# Altium schematic sheet Power Supply Unit.SchDoc: Power Supply Unit
size A4; DrawnBy: Maxime Tousignant-Tremblay; DocumentNumber: GPH-3110-1; Revision: 1; SheetNumber: 3; SheetTotal: 4; SPICEModelCacheSEIOAEZJ: <root> / <DocumentId>SEIOAEZJ</DocumentId> / </root>
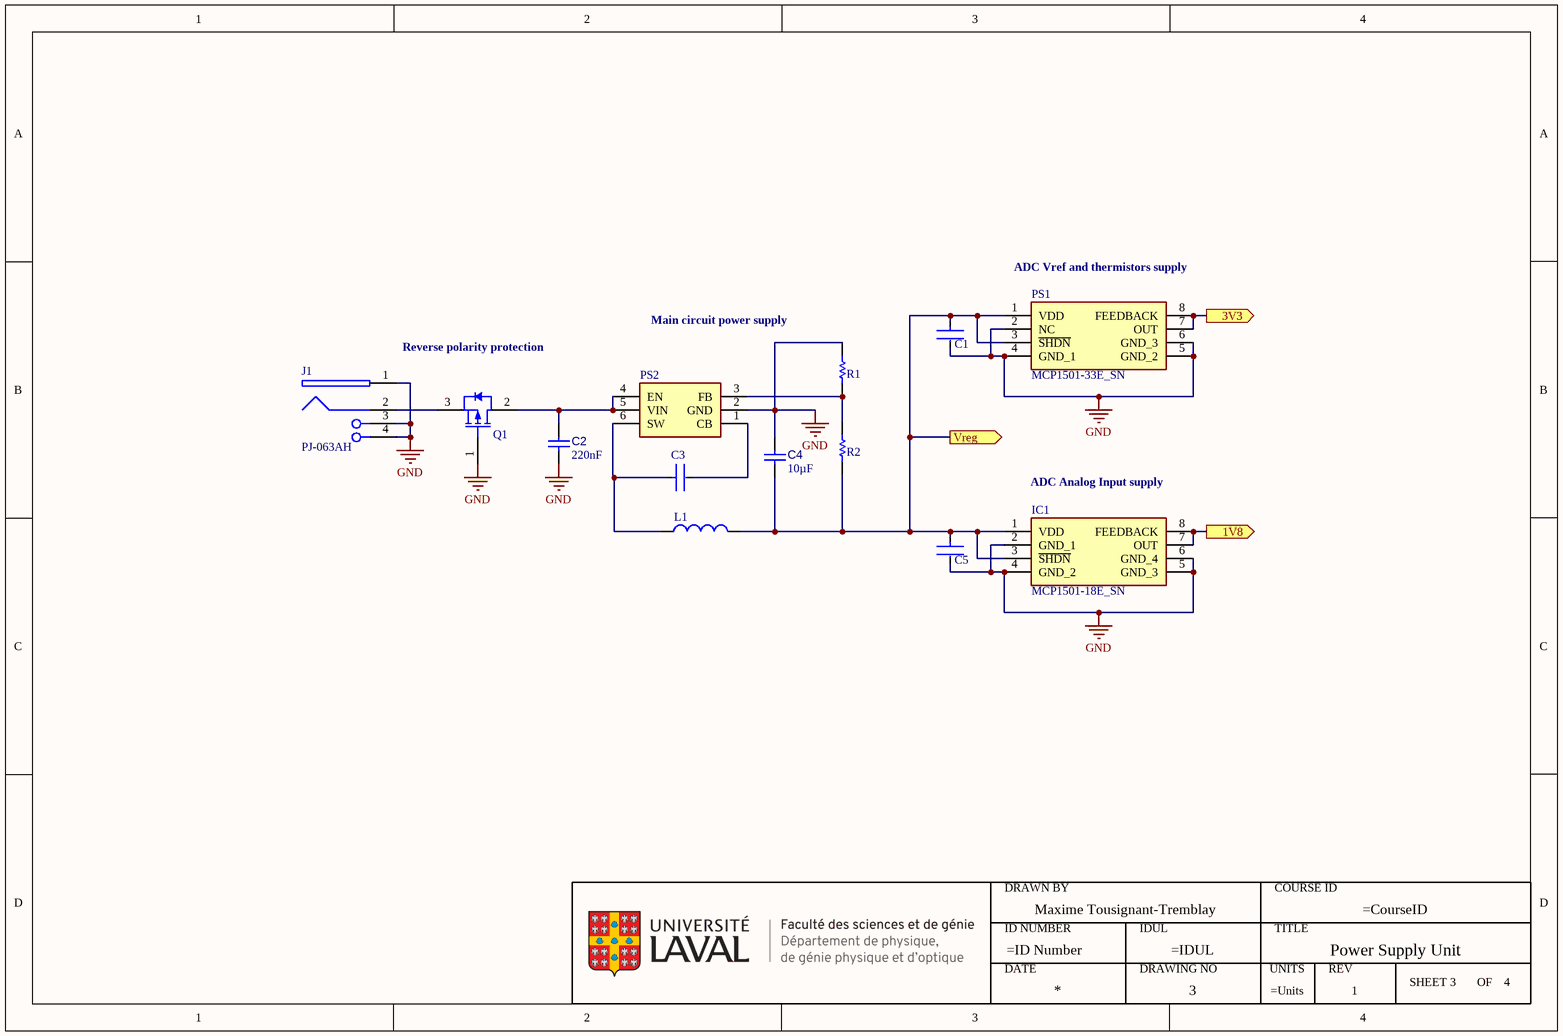
[diagram p0: Power Supply Unit.SchDoc]

## Parts
*1  ULaval FSG-DPGPO  (value not drawn)
C1  CL10A225KO8NNNC  [FP-CL10-IPC_A]  (value not drawn)
C2  value 220nF  [CAPC0402(1005)60_L]  (hidden comment: Capacitor 220nF +/-20% 10V 0402)
C3  CC0603KRX7R9BB104  [FP-CC0603-DA-MFG]  (value not drawn)
C4  value 10µF  [CAPC2013X135X45NL10T25]  (hidden comment: Capacitor 10 uF +/- 10% 16 V 0805)
C5  CL10A225KO8NNNC  [FP-CL10-IPC_A]  (value not drawn)
IC1  MCP1501-18E_SN  [SOIC127P600X175-8N]
J1  PJ-063AH  [CUI-PJ-063AH_V]
L1  7447916  [SMD-1210]  (value not drawn)
PS1  MCP1501-33E_SN  [SOIC127P600X175-8N]
PS2  LMR50410YFQDBVRQ1  [SOT95P280X145-6N]  (value not drawn)
Q1  IPD90P03P4-04  [INF-PG-TO252-3-11_N]  (value not drawn)
R1  RC0402FR-1322K1L  [RESC1005X40X25ML05T10]  (value not drawn)
R2  RC0402FR-0788K7L  [RESC1005X40X25NL05T10]  (value not drawn)

## Ports
1V8 (out, see Processing interface[1A], Processing interface[1B], Processing interface[1C], Processing interface[4A], Processing interface[4B], Processing interface[4C]), 3V3 (out, see Processing interface[1A], Processing interface[1B], Processing interface[1C], Processing interface[4A], Processing interface[4B], Processing interface[4C], Weatstone bridge[2B]), Vreg (out, see Processing interface[1A], Processing interface[1B], Processing interface[1C], Processing interface[3C], Processing interface[4A], Processing interface[4B], Processing interface[4C], Processing interface[4D], Weatstone bridge[2B], Weatstone bridge[2C], Weatstone bridge[3B])

## Nets
GND: C1.2 C2.2 C4.2 C5.2 IC1.2(GND_1) IC1.4(GND_2) IC1.5(GND_3) IC1.6(GND_4) J1.1 J1.3(SHLD) J1.4(SHLD) PS1.2(NC) PS1.4(GND_1) PS1.5(GND_2) PS1.6(GND_3) PS2.2(GND) Q1.1(GATE) R1.2
1V8: IC1.7(OUT) IC1.8(FEEDBACK) ; port 1V8
3V3: PS1.7(OUT) PS1.8(FEEDBACK) ; port 3V3
Vreg: C1.1 C4.1 C5.1 IC1.1(VDD) IC1.3(~{SHDN}) L1.2 PS1.1(VDD) PS1.3(~{SHDN}) R2.1 ; port Vreg
NetC2_1: C2.1 PS2.4(EN) PS2.5(VIN) Q1.2(DRAIN)
NetC3_1: C3.1 L1.1 PS2.6(SW)
NetC3_2: C3.2 PS2.1(CB)
NetJ1_2: J1.2 Q1.3(SOURCE)
NetPS2_3: PS2.3(FB) R1.1 R2.2

## Notes on the sheet
- (near PS1) ADC Vref and thermistors supply
- Reverse polarity protection
- Main circuit power supply
- (near IC1) ADC Analog Input supply
- (in symbol ULaval FSG-DPGPO) DRAWN BY; COURSE ID; ID NUMBER; IDUL; TITLE; DATE; DRAWING NO; UNITS; REV; SHEET; OF

## Library data of the parts
C1 C5 = CMP-13271-000835-1: Cap Ceramic 2.2uF 16V X5R ±10% Pad SMD 0603 +85°C T/R; Case Code (Metric): 1608; Height: 0.8mm; Case/Package: 0603; Depth: 0.8mm; Capacitance: 2.2uF; Voltage Rating: 16V; Case Code (Imperial): 0603; Length: 1.6mm; Packaging: Tape and Reel; Material: Ceramic; Lead Free: Lead Free; Max Operating Temperature: 85°C; Contact Plating: Tin; Thickness: 0.035inch; Radiation Hardening: No; Tolerance: 10%; Min Operating Temperature: -55°C; Voltage: 16V; Dielectric: X5R; Mount: Surface Mount; Package Quantity: 4000; Width: 0.031inch; Voltage Rating (DC): 16V
C2 = CMP-001-00057-3: Chip Capacitor, 220nF +/-20%, 10V, 0402, Thickness 0.6 mm; Tolerance: 10%; Max Operating Temperature: 85°C; Pins: 2; Case/Package: 0402; Mounting Technology: SMT; Voltage Rating: 10V; Min Operating Temperature: -55°C
C3 = CMP-2100-03601-2: CAP CER 0.1UF 50V X7R 0603; Manufacturer: YAGEO; Material: Ceramic; Capacitance: 100 nF; Temperature Coefficient: 15%; Tolerance: 0.1; Value: 100 nF; Description: CC0603 100 nF X7R 10.00% 50 V; Height: 0.9mm; Voltage: 50 V; ComponentLink2Description: Datasheet; Device Class L2: Capacitors; Temperature Range High: +125°C; Category: Cap; Footprint Url: http://www.yageo.com/exep/pages/download/literatures/UPY-C_GEN_24.pdf; ComponentLink2URL: http://www.yageo.com/documents/recent/UPY-GPHC_X7R_6.3V-to-50V_18.pdf; Package: CC0603-DA; Temperature: -55°C to +125°C; Voltage Rating: 50 V; Temperature Characteristic: X7R; Device Class L1: Passive Components; Temperature Range Low: -55°C; Manufacturer Part Number: CC0603KRX7R9BB104; RoHS: TRUE; Automotive: No; Device Class L3: Ceramic Capacitors; Octopart: https://octopart.com/cc0603krx7r9bb104-yageo-42244635; Mouser Description: Multilayer Ceramic Capacitor, CC Series, 0.1 - F, - 10%, X7R, 50 V, 0603 [1608 Metric]; Lead Free: Yes; Digikey Description: CAP CER 0.1UF 50V X7R 0603
C4 = CMP-001-00015-6: Chip Capacitor, 10 uF, +/- 10%, 16 V, 0805 (2012 Metric); Voltage Rating: 16V; Capacitor Type: Ceramic; RoHS Compliant: True; Max Operating Temperature: 85°C; Min Operating Temperature: -55°C; Mounting Technology: SM; Tolerance: 10%; Case/Package: 0805; Pins: 2
IC1 = MCP1501-18E_SN: Integrated Circuit; Manufacturer_Name: Microchip; Manufacturer_Part_Number: MCP1501-18E/SN; Datasheet Link: http://ww1.microchip.com/downloads/en/DeviceDoc/20005474E.pdf; Height: 1.75mm; Mouser Part Number: 579-MCP1501-18E/SN; Mouser Price/Stock: https://www.mouser.co.uk/ProductDetail/Microchip-Technology-Atmel/MCP1501-18E-SN?qs=BA62vJVifGrqbCLW75KQyA%3D%3D; Arrow Part Number: MCP1501-18E/SN; Arrow Price/Stock: https://www.arrow.com/en/products/mcp1501-18esn/microchip-technology?region=nac
J1 = CMP-2000-06898-1: Through Hole Right Angle DC Power Jack, 8 A, 2 mm Center Pin, 2 Position, -25 to 85 degC, RoHS, Bulk; Manufacturer: CUIInc.; Voltage Rating: 24V; Current Rating: 8A; Inside Contact Diameter: 2mm; Insulation Resistance: 100MOhms; Outside Contact Diameter: 6.5mm; Brand: CUI; Termination Style: ThroughHole; Flammability Rating: UL94V-0; Datasheet Version: Rev. 1.02, 03/2016; Manufacturer URL: http://www.cui.com/; Product Category: DCPowerConnectors; Package Description: 2-Pin Through Hole Device, Body 13 x 10 mm, Height 9 mm; Connector Type: DCPowerJack; Factory Pack Quantity: 500; Contact Plating: Nickel; Mounting Style: KinkedPin; Contact Material: Copper; RoHS: True; Mounting Angle: Right; Package Reference: PJ-063AH; Product: Jacks; Contact Gender: Male; Datasheet URL: http://www.cui.com/product/resource/pj-063ah.pdf; Housing Material: PolybutyleneTerephthalate(PBT); Mounting Technology: ThroughHole; Operating Temperature Range: -25Cto+85C
L1 = CMP-0221-00031-1: SMD-Multilayer Inductor WE-MI, L = 4.70 µH; Inductance: 4.70 ÂµH; ComponentLink2Description: Datasheet; PackageReference: SMD-1210; ComponentLink1Description: Manufacturer Link; PackageDescription: Chip Inductor, 2-Leads, Body 3.2 x 2.5 mm; PackageVersion: 2007; ComponentLink1URL: http://www.we-online.com; DatasheetVersion: ver 5, Oct-2004; ComponentLink2URL: http://www.we-online.de/katalog/media/pdf/7447916.pdf
PS1 = MCP1501-33E_SN: Power Supply; Manufacturer_Name: Microchip; Manufacturer_Part_Number: MCP1501-33E/SN; Datasheet Link: http://www.farnell.com/datasheets/2158574.pdf; Height: 1.75mm; Mouser Part Number: 579-MCP1501-33E/SN; Mouser Price/Stock: https://www.mouser.co.uk/ProductDetail/Microchip-Technology-Atmel/MCP1501-33E-SN?qs=BA62vJVifGoOZffNI8tq9A%3D%3D; Arrow Part Number: MCP1501-33E/SN; Arrow Price/Stock: https://www.arrow.com/en/products/mcp1501-33esn/microchip-technology?region=nac
PS2 = LMR50410YFQDBVRQ1: Power Supply; Manufacturer_Name: Texas Instruments; Datasheet Link: https://www.ti.com/product/LMR50410-Q1; Height: 1.45mm; Manufacturer_Part_Number: LMR50410YFQDBVRQ1; Mouser Part Number: 595-MR50410YFQDBVRQ1; Mouser Price/Stock: https://www.mouser.co.uk/ProductDetail/Texas-Instruments/LMR50410YFQDBVRQ1?qs=81r%252BiQLm7BRUAgUFqYZycA%3D%3D; Arrow Part Number: LMR50410YFQDBVRQ1; Arrow Price/Stock: https://www.arrow.com/en/products/lmr50410yfqdbvrq1/texas-instruments?region=nac
Q1 = CMP-013-00034-1: Single P-Channel 30 V 4.5 mOhm 100 nC OptiMOS Power Mosfet - TO-252-3-11; Gate to Source Voltage (Vgs): 20V; Input Capacitance: 10.3nF; Rds On Max: 4.5mR; Drain to Source Breakdown Voltage: 30V; Power Dissipation: 137W; Max Dual Supply Voltage: -30V; Continuous Drain Current (ID): 90A; Turn-Off Delay Time: 70ns; Halogen Free: Halogen Free; Min Operating Temperature: -55°C; RoHS Compliant: Yes; Max Operating Temperature: 175°C; Pins: 3; Lead Free: Lead Free; Packaging: Tape and Reel; Package Quantity: 1; Reach SVHC Compliant: Yes; Drain to Source Voltage (Vdss): -30V; Max Power Dissipation: 137W; Element Configuration: Single; Drain to Source Resistance: 4.5mR; Series: OptiMOS™; Case/Package: TO-252-3
R1 = CMP-2002-07868-1: Manufacturer: Yageo / Phycomp; Part Number: RC0402FR-1322K1L
R2 = CMP-2002-07828-1: Manufacturer: Yageo; Part Number: RC0402FR-0788K7L